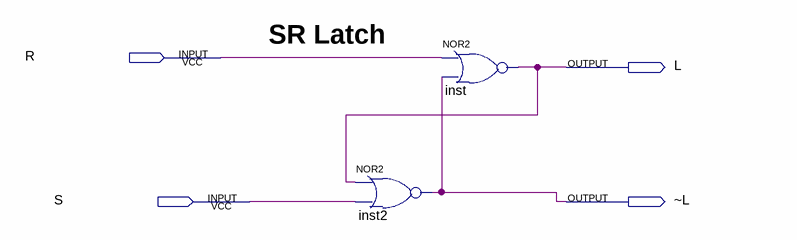
[diagram p0: schematic sheet]
// Quartus schematic SRLATCHY.bdf as structural Verilog: 2 symbols, 4 pins
module SRLATCHY (
  input  R,
  input  S,
  output L,
  output \~L 
);

  nor inst2 (\~L , L, S);
  nor inst (L, R, \~L );

  // Notes on the sheet:
  //   SR Latch
endmodule
